# EAGLE design xiao-rp2040 (EAGLE 9.5.1)
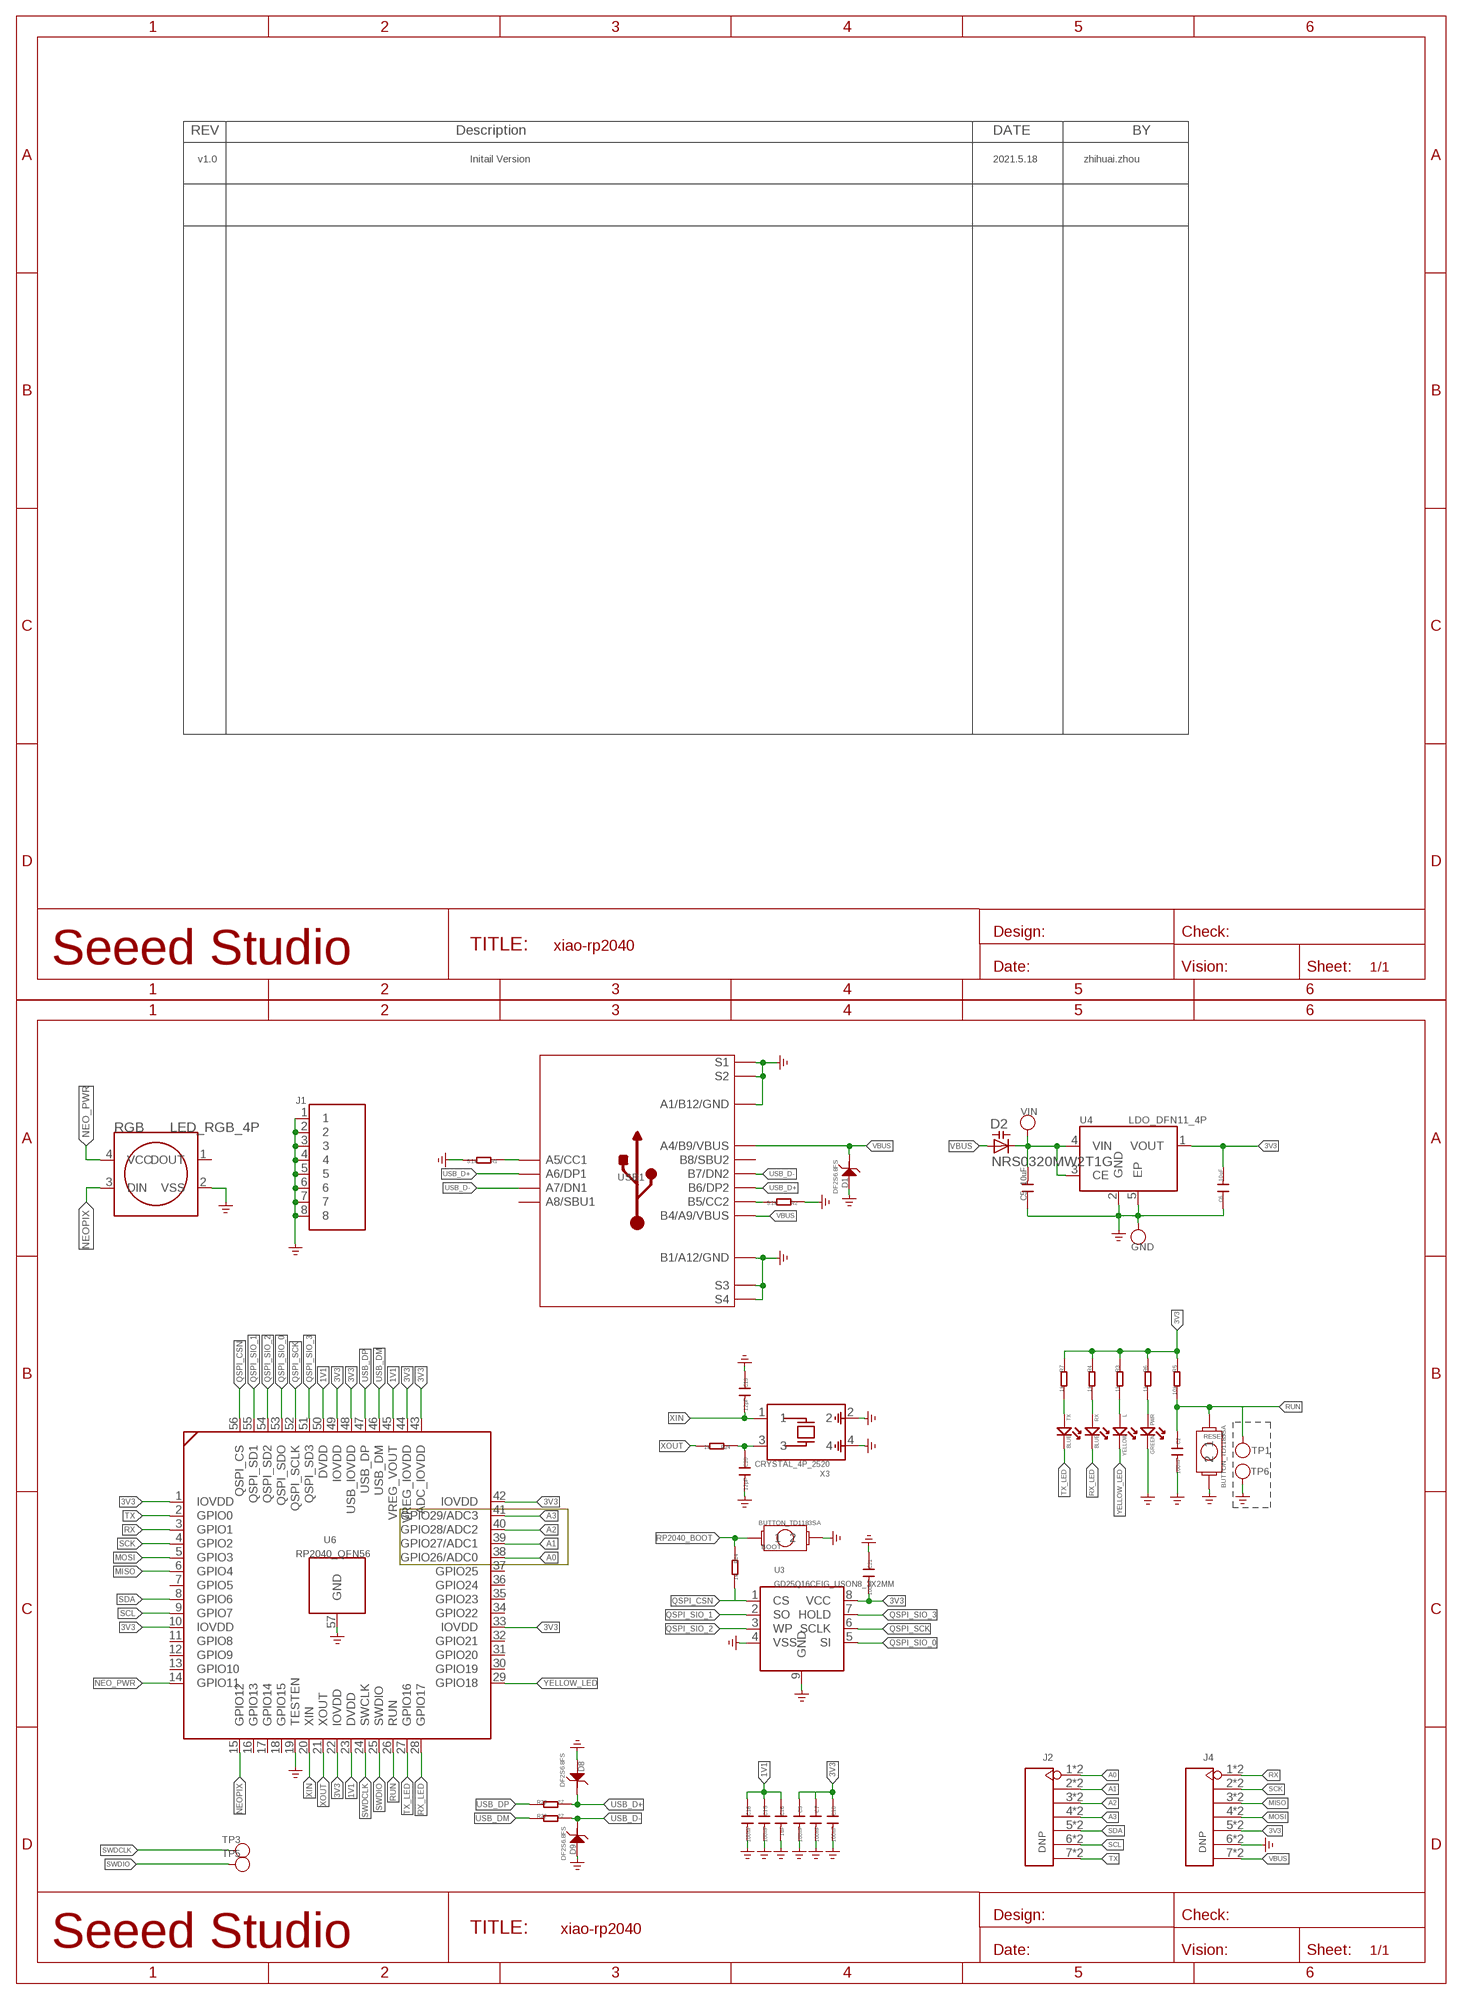
[diagram p0: schematic, sheet 1]

## Parts
BOOT  BUTTON_TD1183SA  [BUTTON_TD1183SA]
C2  100nF  CAP\0201NNS  [0201_NORMAL\NOSILK]
C3  100nF  CAP\0201NNS  [0201_NORMAL\NOSILK]
C5  10uF  C-0402  [C0402]
C6  10uF  C-0402  [C0402]
C7  100nF  CAP\0201NNS  [0201_NORMAL\NOSILK]
C10  100nF  CAP\0201NNS  [0201_NORMAL\NOSILK]
C15  100nF  CAP\0201NNS  [0201_NORMAL\NOSILK]
C16  1uF  CAP\0201NNS  [0201_NORMAL\NOSILK]
C18  100nF  CAP\0201NNS  [0201_NORMAL\NOSILK]
C19  12pF  CAP\0201NNS  [0201_NORMAL\NOSILK]
C20  12pF  CAP\0201NNS  [0201_NORMAL\NOSILK]
C21  100nF  CAP\0201NNS  [0201_NORMAL\NOSILK]
D1  DF2S6.8FS  D-ESD-2P'DF2S6.8FS'  [SOD-923]
D2  NRS0320MW2T1G  DIODE_CAPACITANCE-SOD523  [SOD523]
D8  DF2S6.8FS  D-ESD-2P'DF2S6.8FS'  [SOD-923]
D9  DF2S6.8FS  D-ESD-2P'DF2S6.8FS'  [SOD-923]
GND  TEST-POINT'4080'  [TP-80X40MIL]
J1  SHIELDING-COVER-XIAO_RP2040_PRD  [SHIELDING-COVER_XIAO_RP2040_PRD]
J2  DNP  HEADER-7P-HALF-HOLE-2.54  [H7-HALF-HOLE-2.54]
J4  DNP  HEADER-7P-HALF-HOLE-2.54  [H7-HALF-HOLE-2.54]
L  YELLOW  LED-0402  [LED-0402]
PWR  GREEN  LED-0402  [LED-0402]
R1  5.1k  R-0201  [R0201]
R2  5.1k  R-0201  [R0201]
R3  1k  R-0201  [R0201]
R4  1k  R-0201  [R0201]
R5  10k  R-0201  [R0201]
R6  1k  R-0201  [R0201]
R7  1k  R-0201  [R0201]
R14  1k  R-0201  [R0201]
R22  27  R-0201  [R0201]
R23  27  R-0201  [R0201]
R24  1k  R-0201  [R0201]
RESET  BUTTON_TD1183SA  [BUTTON_TD1183SA]
RGB  LED_RGB_4P  [LED_RGB_2427]
RX  BLUE  LED-0402  [LED-0402]
TP1  TEST-POINT'4545'  [TP-D45MIL]
TP3  TEST-POINT'4545'  [TP-D45MIL]
TP5  TEST-POINT'4545'  [TP-D45MIL]
TP6  TEST-POINT'4545'  [TP-D45MIL]
TX  BLUE  LED-0402  [LED-0402]
U3  GD25Q16CEIG_USON8_3X2MM  [GD25Q16CEIG_USON8_3X2MM]
U4  LDO_DFN11_4P  [LDO_DFN1*1_4P]
U6  RP2040_QFN56  [RP2040_QFN56]
USB1  USB2.0-TYPE-C  [USB2.0-TYPE-C]
VIN  TEST-POINT'4080'  [TP-80X40MIL]
X3  CRYSTAL_4P_2520  [CRYSTAL_4P_2520]

## Nets
1V1: C15.1 C16.1 C18.1 U6.23(DVDD) U6.45(VREG_VOUT) U6.50(DVDD)
3V3: C3.1 C6.2 C7.1 C10.1 C21.2 J4.5 J4.17 R3.1 R4.1 R5.1 R6.1 R7.1 U3.8(VCC) U4.1(VOUT) U6.1(IOVDD) U6.10(IOVDD) U6.22(IOVDD) U6.33(IOVDD) U6.42(IOVDD) U6.43(ADC_IOVDD) U6.44(VREG_IOVDD) U6.48(USB_IOVDD) U6.49(IOVDD)
A0: J2.1 J2.13 U6.38(GPIO26/ADC0)
A1: J2.2 J2.14 U6.39(GPIO27/ADC1)
A2: J2.3 J2.15 U6.40(GPIO28/ADC2)
A3: J2.4 J2.16 U6.41(GPIO29/ADC3)
GND: BOOT.2 C2.2 C3.2 C5.1 C6.1 C7.2 C10.2 C15.2 C16.2 C18.2 C19.1 C20.2 C21.1 D1.2 D8.2 D9.2 GND.1(T) J1.1 J1.2 J1.3 J1.4 J1.5 J1.6 J1.7 J1.8 J4.6 J4.18 PWR.- R1.2 R2.1 RESET.2 RGB.2(VSS) TP6.T U3.4(VSS) U3.9(GND) U4.2(GND) U4.5(EP) U6.19(TESTEN) U6.57(GND) USB1.A1_B12(A1/B12/GND) USB1.B1_A12(B1/A12/GND) USB1.S1 USB1.S2 USB1.S3 USB1.S4 USB1.S5(S1) USB1.S6(S2) X3.2 X3.4 ; supply symbol labelled GND_POWER
MISO: J4.3 J4.15 U6.6(GPIO4)
MOSI: J4.4 J4.16 U6.5(GPIO3)
N$1: R1.1 USB1.A5(A5/CC1)
N$2: R2.2 USB1.B5(B5/CC2)
N$5: L.+ R3.2
N$6: R7.2 TX.+
N$8: C20.1 R24.1 X3.3
N$9: R4.2 RX.+
N$16: PWR.+ R6.2
NEO_PWR: RGB.4(VCC) U6.14(GPIO11)
NEOPIX: RGB.3(DIN) U6.15(GPIO12)
QSPI_CSN: R14.2 U3.1(CS) U6.56(QSPI_CS)
QSPI_SCK: U3.6(SCLK) U6.52(QSPI_SCLK)
QSPI_SIO_0: U3.5(SI) U6.53(QSPI_SDO)
QSPI_SIO_1: U3.2(SO) U6.55(QSPI_SD1)
QSPI_SIO_2: U3.3(WP) U6.54(QSPI_SD2)
QSPI_SIO_3: U3.7(HOLD) U6.51(QSPI_SD3)
RP2040_BOOT: BOOT.1 R14.1
RUN: C2.1 R5.2 RESET.1 TP1.T U6.26(RUN)
RX: J4.1 J4.13 U6.3(GPIO1)
RX_LED: RX.- U6.28(GPIO17)
SCK: J4.2 J4.14 U6.4(GPIO2)
SCL: J2.6 J2.18 U6.9(GPIO7)
SDA: J2.5 J2.17 U6.8(GPIO6)
SWDCLK: TP3.T U6.24(SWCLK)
SWDIO: TP5.T U6.25(SWDIO)
TX: J2.7 J2.19 U6.2(GPIO0)
TX_LED: TX.- U6.27(GPIO16)
USB_D+: D8.1 R23.2 USB1.A6(A6/DP1) USB1.B6(B6/DP2)
USB_D-: D9.1 R22.2 USB1.A7(A7/DN1) USB1.B7(B7/DN2)
USB_DM: R22.1 U6.46(USB_DM)
USB_DP: R23.1 U6.47(USB_DP)
VBUS: D1.1 D2.A J4.7 J4.19 USB1.A4_B9(A4/B9/VBUS) USB1.B4_A9(B4/A9/VBUS)
VIN: C5.2 D2.C U4.3(CE) U4.4(VIN) VIN.1(T)
XIN: C19.2 U6.20(XIN) X3.1
XOUT: R24.2 U6.21(XOUT)
YELLOW_LED: L.- U6.29(GPIO18)
Unconnected: RGB.1(DOUT) U6.7(GPIO5) U6.11(GPIO8) U6.12(GPIO9) U6.13(GPIO10) U6.16(GPIO13) U6.17(GPIO14) U6.18(GPIO15) U6.30(GPIO19) U6.31(GPIO20) U6.32(GPIO21) U6.34(GPIO22) U6.35(GPIO23) U6.36(GPIO24) U6.37(GPIO25) USB1.A8(A8/SBU1) USB1.B8(B8/SBU2)

## Notes on the sheet
- v1.0 | Initail Version | 2021.5.18 | zhihuai.zhou

## Library data of the parts
BOOT RESET = BUTTON_TD1183SA:BUTTON_TD1183SA: 德艺隆:TD-1183SA/311020740
C2 C3 C7 C10 C15 C16 C18-C21 = Seeed-Discrete:CAP: Ceramic Capacitors
C5 C6 = XIAO RP2040 PRD v1.0:C*: Ceramic Capacitors
D1 D8 D9 = Discrete-new:D-ESD-2P: SOD-923:304060009;SOD-123:304060001
D2 = XIAO RP2040 PRD v1.0:DIODE_CAPACITANCE-: Capacity DIODE
GND VIN = Discrete-new:TEST-POINT
J1 = XIAO RP2040 PRD v1.0:SHIELDING-COVER-XIAO_RP2040_PRD
J2 J4 = Connector-new:HEADER-7P-HALF-HOLE
L PWR RX TX = Discrete-small:LED
R1-R7 R14 R22-R24 = XIAO RP2040 PRD v1.0:R*
RGB = XIAO RP2040 PRD v1.0:LED_RGB_4P
TP1 TP3 TP5 TP6 = Discrete-new:TEST-POINT; PARTNO: DNP
U3 = FLASH_GD25Q16CEIG_2:GD25Q16CEIG_USON8_3X2MM
U4 = LDO_DFN1X1_4P:LDO_DFN1*1_4P
U6 = RP2040_QFN56:RP2040_QFN56
USB1 = USB C:USB2.0-TYPE-C
X3 = CRYSTAL_4P:CRYSTAL_4P_2520

## Net classes
1 power: width 0.152 mm, drill 0.152 mm, clearance 0.152 mm
2 gnd: width 0.152 mm, drill 0.152 mm, clearance 0.152 mm
3 usbvcc: width 0.152 mm, drill 0.152 mm, clearance 0.152 mm

## Board
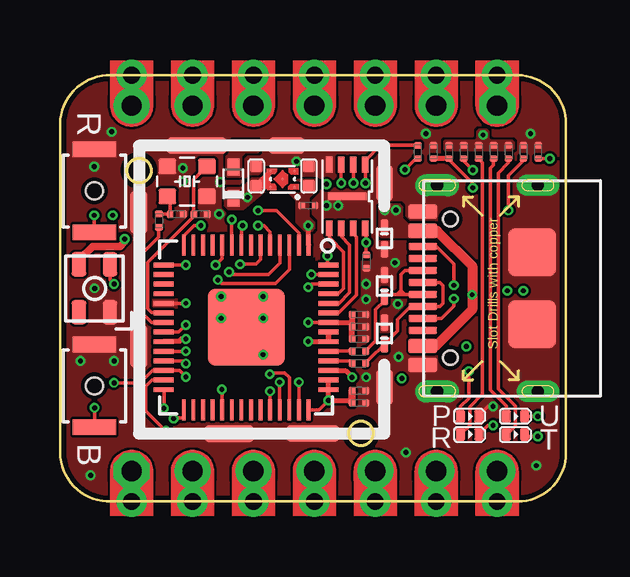
[diagram p1: board, top side]
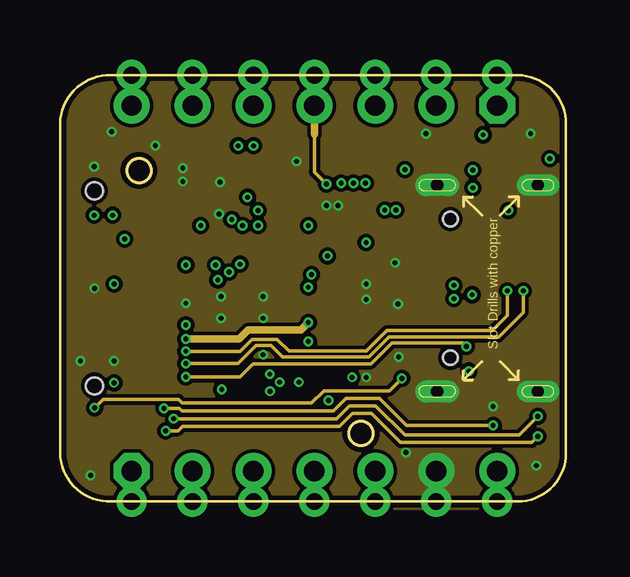
[diagram p2: board, inner layer Route2]
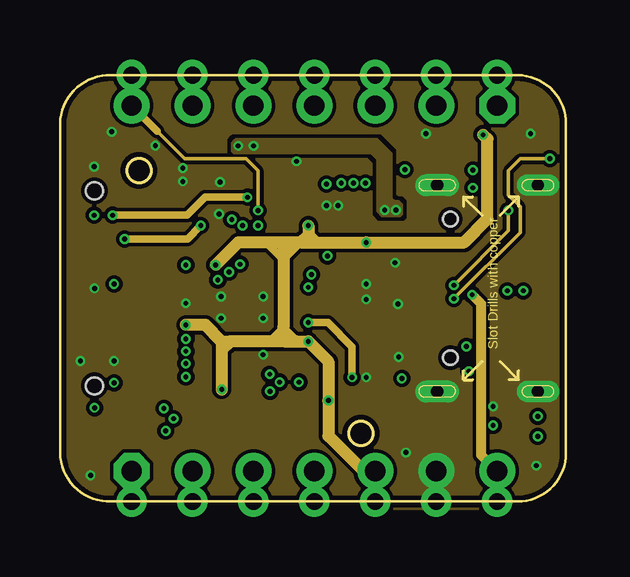
[diagram p3: board, inner layer Route15]
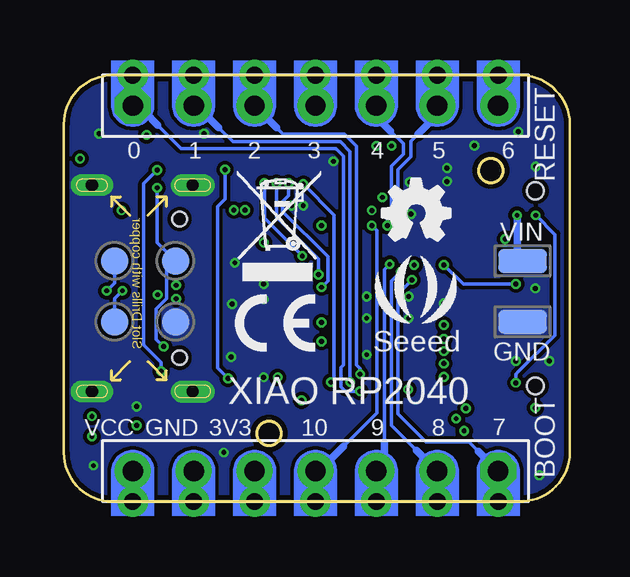
[diagram p4: board, bottom side, seen from below]

Size 21.1 x 17.78 mm. Coordinates in mm from the lower left corner, seen from the top.
Outline: 2.13,0 19.07,0 arc90 21.1,2.03 21.1,15.75 arc90 19.07,17.78 2.13,17.78 arc90 0,15.75 0,2.03 arc90 2.13,0
Copper layers (1+2*15+16): Top 0.035mm / dielectric 0.2mm / Route2 0.0175mm / dielectric 1.1mm / Route15 0.0175mm / dielectric 0.2mm / Bottom 0.035mm
Design rules "SeeedStudio_2layer_DRU_no_angle_20140221 *": minimum track width 1mil, minimum drill 8mil, track to track 4mil, track to pad 4mil, pad to pad 6mil, via to via 4mil, smd to smd 0mil, copper to edge 8mil, drill to drill 10mil, minimum pad ring 4mil, minimum via ring 4mil, stop-mask expansion 2mil, vias tented up to drill 25mil, thermal gap 0mil
tRestrict: area 4.9,4.3 to 10.6,10.2

### Footprints (pad centres in the part's own frame; a part is rotated, then mirrored left to right if it is on the bottom)
BUTTON_TD1183SA = smd 0.65 x 1.8: 1 -1.725,0; 2 1.725,0 | hole 0.7: 0,0
0201_NORMAL\NOSILK = smd 0.279 x 0.318: 1 -0.279,0; 2 0.279,0
C0402 = smd 0.508 x 0.508: 1 -0.406,0; 2 0.406,0
SOD-923 = smd 0.7 x 0.3: 1 -0.45,0; 2 0.45,0
SOD523 = smd 0.7 x 0.5: A 0.7,0; C -0.6,0
TP-80X40MIL = smd 2.032 x 1.016: 1 0,0
SHIELDING-COVER_XIAO_RP2040_PRD = smd 0.7 x 1.778: 1 -4.953,3.556; 2 -4.953,-2.032 | smd 2.032 x 0.7: 3 -1.18,-5.673 | smd 2.2 x 0.7: 4 2.29,-5.668 | smd 0.7 x 1.5: 5 5.283,-3.737; 6 5.283,4.772 | smd 1.5 x 0.7: 7 1.216,6.332 | smd 2.5 x 0.7: 8 -2.54,6.332 | hole 1: -4.953,5.3; 4.3,-5.672
H7-HALF-HOLE-2.54 = drill 0.85 pad 1.5 octagon: 1 0,7.62 | drill 0.85 pad 1.5: 2 0,5.08; 3 0,2.54; 4 0,0; 5 0,-2.54; 6 0,-5.08; 7 0,-7.62 | drill 0.7 pad 1.27: 13 -1.27,7.62; 14 -1.27,5.08; 15 -1.27,2.54; 16 -1.27,0; 17 -1.27,-2.54; 18 -1.27,-5.08; 19 -1.27,-7.62
LED-0402 = smd 0.385 x 0.508: + -0.383,0; - 0.383,0
R0201 = smd 0.279 x 0.318: 1 -0.279,0; 2 0.279,0
LED_RGB_2427 = smd 1 x 0.6: 1 1,-0.65; 2 1,0.65; 3 -1,0.65; 4 -1,-0.65
TP-D45MIL = smd 1.143 x 1.143: T 0,0
GD25Q16CEIG_USON8_3X2MM = smd 0.65 x 0.3: 1 -1.33,0.75; 2 -1.33,0.25; 3 -1.33,-0.25; 4 -1.33,-0.75; 5 1.33,-0.75; 6 1.33,-0.25; 7 1.33,0.25; 8 1.33,0.75 | smd 0.3 x 1.6: 9 0,0
LDO_DFN1*1_4P = smd 0.1 x 0.1: 1 -0.33,-0.5; 2 0.33,-0.5; 3 0.33,0.51; 4 -0.33,0.5; 5 0,0
RP2040_QFN56 = smd 0.875 x 0.2: 1 -3.438,2.6; 2 -3.438,2.2; 3 -3.438,1.8; 4 -3.438,1.4; 5 -3.438,1; 6 -3.438,0.6; 7 -3.438,0.2; 8 -3.438,-0.2; 9 -3.438,-0.6; 10 -3.438,-1; 11 -3.438,-1.4; 12 -3.438,-1.8; 13 -3.438,-2.2; 14 -3.438,-2.6; 29 3.438,-2.6; 30 3.438,-2.2; 31 3.438,-1.8; 32 3.438,-1.4; 33 3.438,-1; 34 3.438,-0.6; 35 3.438,-0.2; 36 3.438,0.2; 37 3.438,0.6; 38 3.438,1; 39 3.438,1.4; 40 3.438,1.8; 41 3.438,2.2; 42 3.438,2.6 | smd 0.2 x 0.875: 15 -2.6,-3.438; 16 -2.2,-3.438; 17 -1.8,-3.438; 18 -1.4,-3.438; 19 -1,-3.438; 20 -0.6,-3.438; 21 -0.2,-3.438; 22 0.2,-3.438; 23 0.6,-3.438; 24 1,-3.438; 25 1.4,-3.438; 26 1.8,-3.438; 27 2.2,-3.438; 28 2.6,-3.438; 43 2.6,3.438; 44 2.2,3.438; 45 1.8,3.438; 46 1.4,3.438; 47 1,3.438; 48 0.6,3.438; 49 0.2,3.438; 50 -0.2,3.438; 51 -0.6,3.438; 52 -1,3.438; 53 -1.4,3.438; 54 -1.8,3.438; 55 -2.2,3.438; 56 -2.6,3.438 | smd 3.2 x 3.2: 57 0,0
USB2.0-TYPE-C = smd 1.2 x 0.6: A1_B12 0.05,3.2; A4_B9 0.05,2.4; B1_A12 0.05,-3.2; B4_A9 0.05,-2.4 | smd 1.2 x 0.3: A5 0.05,1.25; A6 0.05,0.25; A7 0.05,-0.25; A8 0.05,-1.25; B5 0.05,-1.75; B6 0.05,-0.75; B7 0.05,0.75; B8 0.05,1.75 | drill 0.508 pad 0.889 long: S1 -4.75,4.3; S2 -4.75,-4.3 | drill 0.508 pad 0.914 long: S3 -0.55,4.3; S4 -0.55,-4.3 | smd 2 x 2: S5 -4.5,1.5; S6 -4.5,-1.5 | hole 0.6: -1.1,-2.89; -1.1,2.89
CRYSTAL_4P_2520 = smd 0.75 x 0.65: 1 -0.825,-0.625; 2 0.825,-0.625; 3 0.825,0.625; 4 -0.825,0.625

### Placement (x,y rotation side)
BOOT  1.44,4.83 90 top
C2  15.57,14.58 90 top
C3  10.36,12.34 0 top
C5  8.18,13.58 270 top
C6  10.38,13.58 270 top
C7  12.46,4.62 0 top
C10  12.46,4.11 0 top
C15  12.46,7.8 0 top
C16  12.46,6.78 0 top
C18  12.46,7.29 0 top
C19  5.87,11.97 180 top
C20  4.87,11.97 0 top
C21  12.78,10.01 90 top
D1  13.53,10.97 270 top
D2  7.23,13.25 90 top
D8  13.53,8.99 90 top
D9  13.53,7.01 90 top
GND  1.97,7.49 0 bottom
J1  8.25,8.51 0 top
J2  10.61,16.51 270 top
J4  10.61,1.27 90 top
L  18.99,3.56 0 top
PWR  17.09,3.56 0 top
R1  19.94,14.58 90 top
R2  19.32,14.58 270 top
R3  18.08,14.58 270 top
R4  17.46,14.58 270 top
R5  16.22,14.58 270 top
R6  16.84,14.58 270 top
R7  18.7,14.58 270 top
R14  14.93,14.58 90 top
R22  12.46,5.77 0 top
R23  12.46,6.27 0 top
R24  4.12,11.71 270 top
RESET  1.44,12.95 90 top
RGB  1.44,8.89 270 top
RX  17.09,2.79 0 top
TP1  16.45,10.03 0 bottom
TP3  18.99,7.49 0 bottom
TP5  18.99,10.03 0 bottom
TP6  16.45,7.49 0 bottom
TX  18.99,2.79 0 top
U3  11.98,12.73 270 top
U4  9.29,13.44 90 top
U6  7.76,7.26 270 top
U$4  [OSHW_FILLX100_NOTEXT]  7.82,10.9 0 bottom
U$6  [SEEED-SILK--TNAME-160*153MIL]  6.4,8.93 0 bottom
USB1  15.18,8.89 180 top
VIN  1.97,10.03 180 bottom
X3  5.3,13.35 180 top

### Tracks (layer width: path | path; a pad name or v marks a point on that pad's centre or on a via)
1V1  (via drill 0.2 pad 0.41)
  Top 0.152: v10.36,7.46 U6.50
  Top 0.203: U6.50 12.18,7.46 C18.1 | U6.23 4.34,6.68 4.97,6.68 5.07,6.78 v5.25,6.78 | U6.45 11.9,5.46 v12.18,5.18
  Top 0.254: C15.1 C18.1 C16.1
  Route2 0.305: v5.25,6.78 7.48,6.78 7.85,7.16 10.05,7.16 v10.36,7.46
  Route15 0.305: v12.18,5.18 12.18,6.45 11.17,7.46 v10.36,7.46
3V3  (via drill 0.2 pad 0.41)
  Top 0.152: U6.22 4.95,7.06 v5.25,7.37 | v11.19,4.22 10.8,3.83 U6.42 | U3.8 12.77,11.36 v12.77,10.8 12.77,10.3 C21.2 | v6.75,4.67 6.76,4.66 U6.33 | v6.49,9.87 6.76,10.14 U6.10
  Top 0.203: U6.48 U6.49 11.2,6.68 v10.36,6.68 | U6.44 U6.43 v11.19,4.22 12.08,4.22 C10.1 | U6.42 10.38,3.84 | U6.1 v10.36,11.51
  Top 0.254: J4.5 J4.17
  Top 0.305: C10.1 C7.1
  Route15 0.305: 8.59,10.8 9.26,10.14 9.31,10.14 9.37,10.14 10.04,10.8 | 8.59,6.68 8.73,6.68 9.31,7.26 9.85,6.73 9.85,6.68
  Route15 0.508: 9.34,6.68 9.85,6.68 v10.36,6.68 11.19,5.84 v11.19,4.22 11.19,2.73 12.66,1.27 J4.5 | 9.34,6.68 8.59,6.68 7.1,6.68 | 6.75,6.68 7.1,6.68 | 10.36,10.8 10.67,10.8 | v10.36,11.51 10.36,11.12 | 10.36,11.12 10.36,10.8 | 10.04,10.8 10.36,10.8 | 10.04,10.8 9.31,10.8 | 9.31,10.8 8.59,10.8 7.43,10.8 v6.49,9.87 | 7.1,6.68 6.75,6.33 | 10.04,10.8 10.36,11.12 | 10.36,11.12 10.67,10.8 | 9.31,10.8 9.31,10.14 9.31,7.26 9.31,6.71 9.34,6.68 | 6.75,6.68 6.75,6.33 | v17.65,15.29 17.82,15.11 17.82,11.77 16.85,10.8 v12.77,10.8 10.67,10.8 | v5.25,7.37 6.06,7.37 6.75,6.68 | 6.75,6.33 v6.75,4.67
  pour Top: 9.5,13.06 9.9,13.45 10.63,13.45 10.72,13.36 10.72,12.99 10.38,12.65 10.38,11.89 10.62,11.65 10.62,11.38 10.51,11.26 10.22,11.26 9.85,11.63 9.85,12.55 9.5,12.89
  pour Top: 16.06,15.07 15.99,15.01 15.99,14.69 16.06,14.63 18.85,14.63 18.97,14.74 18.97,14.96 18.86,15.06 17.99,15.06 17.91,15.14 17.91,15.43 17.81,15.53 17.47,15.53 17.37,15.43 17.37,15.14 17.3,15.07
A0  (via drill 0.2 pad 0.41)
  Top 0.152: v8.76,4.6 U6.38
  Top 0.254: J2.1 J2.13
  Bottom 0.152: 17.19,15.7 16.21,14.72 9.75,14.72 9.44,14.41 9.44,5.7 9.54,5.6 9.54,4.79 9.35,4.6 9,4.6 v8.76,4.6
  Bottom 0.305: 17.19,15.7 17.72,16.23 17.95,16.23 J2.1
A1  (via drill 0.2 pad 0.41)
  Top 0.152: v9.16,4.98 U6.39
  Top 0.254: J2.2 J2.14
  Bottom 0.102: J2.2 15.69,16
  Bottom 0.152: 14.65,15.6 14.05,15 9.57,15 9.16,14.59 v9.16,4.98
  Bottom 0.305: 14.65,15.6 15.08,16.03 15.66,16.03 15.69,16
A2  (via drill 0.2 pad 0.41)
  Top 0.152: U6.40 9.57,5.17 9.36,5.37 8.81,5.37 v8.75,5.31
  Top 0.254: J2.3 J2.15
  Bottom 0.152: 12.34,15.7 12.34,15.65 | v8.75,5.31 8.75,5.55 8.9,5.7 8.9,14.82 9.39,15.32 11.96,15.32 12.24,15.6
  Bottom 0.305: J2.3 12.34,15.7 12.24,15.6
A3  (via drill 0.2 pad 0.41)
  Top 0.152: v9.96,4.98 U6.41
  Top 0.254: J2.4 J2.16
  Route2 0.152: 10.61,15.32 10.61,13.74 v11.12,13.23
  Route2 0.305: J2.4 10.61,15.32
  Bottom 0.152: v9.96,4.98 9.83,5.11 9.83,11.95 v11.12,13.23
GND  (via drill 0.2 pad 0.41)
  Top 0.152: v18.06,3.96 17.84,3.96 17.47,3.59 PWR.- | v5.25,8.27 v5.25,8.26 U6.19
  Top 0.305: U6.57 7.76,6.83 v8.48,6.12
  other vias: 8.48,7.65 6.72,7.65 8.48,8.55 1.44,8.89 0.86,5.87 2.25,5.87 1.43,13.97 2.15,15.42 3.98,14.85 6.68,13.32 11.12,12.34 11.6,12.34 12.77,8.43 12.77,9.07 12.77,5.18 1.28,1.09 19.87,1.5 14.43,2.04 19.63,15.34 15.26,15.34 6.72,8.55 5.12,13.91 9.86,14.19 14.13,6.03 14.09,8.24 13.98,9.96 6.63,11.99 5.12,13.35
  pour Top (rank 3, no thermals): -0.19,17.93 21.51,17.93 21.53,17.91 21.53,-0.28 3.88,-0.28 3.88,-0.91 2.08,-0.91 2.08,-0.25 -0.21,-0.25
  pour Route2 (isolate 0.152, rank 6, no thermals): -0.19,17.93 21.51,17.93 21.53,17.91 21.53,-0.28 3.88,-0.28 3.85,-1.24 2.08,-1.24 2.08,-0.25 -0.21,-0.25
  pour Route15 (isolate 0.152, rank 6, no thermals): -0.19,17.93 21.51,17.93 21.53,17.91 21.53,-0.28 3.88,-0.28 3.85,-1.57 2.08,-1.57 2.08,-0.25 -0.21,-0.25
  pour Bottom (isolate 0.152, rank 6, no thermals): -0.19,17.93 21.51,17.93 21.53,17.91 21.53,-0.28 3.88,-0.28 3.85,-1.93 2.08,-1.93 2.08,-0.25 -0.21,-0.25
MISO  (via drill 0.2 pad 0.41)
  Top 0.152: U6.6 8.37,10.69 8.37,10.08 8.19,9.9 v7.51,9.9
  Top 0.254: J4.3 J4.15
  Bottom 0.152: v7.51,9.9 7.74,9.67 7.74,2.49
  Bottom 0.305: J4.3 7.74,1.6 7.74,2.49
MOSI  (via drill 0.2 pad 0.41)
  Top 0.152: U6.5 8.76,11.24 8.5,11.51 v8.26,11.51
  Top 0.254: J4.4 J4.16
  Bottom 0.152: 9.59,2.15 8.04,3.7 8.04,11.29 v8.26,11.51
  Bottom 0.305: 9.44,2.3 9.59,2.15 10.47,1.27 J4.4
N$1  (via drill 0.2 pad 0.41)
  Top 0.152: USB1.A5 15.91,7.64 16.43,8.15 v16.43,8.46 | R1.1 v20.43,14.3
  Route15 0.152: v16.43,8.46 19.19,11.23 19.19,12.29 18.7,12.79 18.7,13.79 19.21,14.3 v20.43,14.3
N$2  (via drill 0.2 pad 0.41)
  Top 0.152: USB1.B5 15.69,10.64 16.43,9.91 v16.43,9.02 | v18.7,12.14 18.7,13.59 19.32,14.21 R2.2
  Route15 0.152: v16.43,9.02 18.7,11.29 v18.7,12.14
N$5
  Top 0.152: R3.2 18.08,14.04 17.95,13.91 17.95,4.65 18.61,3.99 L.+
N$6
  Top 0.152: TX.+ 18.64,2.79 18.99,3.15 18.99,3.99 18.28,4.7 18.28,13.7 18.7,14.12 R7.2
N$8
  Top 0.152: R24.1 4.57,11.99 C20.1 4.59,12.61 X3.3
N$9
  Top 0.152: RX.+ 17.09,3.18 17.09,3.95 17.62,4.48 17.62,14.14 R4.2
N$16  (via drill 0.2 pad 0.41)
  Top 0.152: PWR.+ 16.7,3.96 17.05,4.31 v17.05,5.44 | R6.2 16.84,14.2 v17.21,13.82
  Bottom 0.152: v17.21,13.82 17.77,13.26 17.77,6.53 17.05,5.8 v17.05,5.44
NEO_PWR  (via drill 0.2 pad 0.41)
  Top 0.152: RGB.4 0.79,10.07 | U6.14 5.16,11.08 5.59,11.51 v5.87,11.51
  Top 0.305: 0.79,10.07 1.37,10.64 2.5,10.64 2.7,10.84 v2.7,10.95
  Route15 0.305: v2.7,10.95 5.31,10.95 v5.87,11.51
NEOPIX  (via drill 0.2 pad 0.41)
  Top 0.152: v5.25,9.87 U6.15 | 2.09,9.49 RGB.3 2.09,9.23 v2.25,9.07
  Bottom 0.152: v2.25,9.07 4.45,9.07 v5.25,9.87
QSPI_CSN  (via drill 0.2 pad 0.41)
  Top 0.152: v11.16,10.25 11.15,10.24 11.15,9.92 U6.56 | R14.2 13.37,14.86 12.73,14.22 U3.1 12.74,14.04 v12.74,13.28
  Bottom 0.152: v11.16,10.25 12.74,11.83 v12.74,13.28
QSPI_SCK
  Top 0.152: U3.6 11.73,11.05 12.08,10.7 12.08,8.72 11.63,8.26 U6.52
QSPI_SIO_0
  Top 0.152: 11.28,11.23 11.28,11.35 U3.5 11.23,11.01 11.83,10.41 11.83,8.89 11.6,8.66 U6.53
QSPI_SIO_1  (via drill 0.2 pad 0.41)
  Top 0.152: v10.48,9.47 v10.49,9.46 U6.55 | v12.24,13.28 U3.2
  Bottom 0.152: 12.24,13.31 v12.24,13.28 12.24,11.86 10.48,10.11 v10.48,9.47
QSPI_SIO_2  (via drill 0.2 pad 0.41)
  Top 0.152: v11.73,13.28 U3.3 | v10.36,8.94 10.48,9.06 U6.54
  Bottom 0.152: v11.73,13.28 11.73,12.76 11.98,12.5 11.98,12.09 10.1,10.21 10.1,9.2 v10.36,8.94
QSPI_SIO_3
  Top 0.152: U6.51 11.61,7.86 12.37,8.62 12.37,11.04 12.23,11.18 U3.7
RP2040_BOOT  (via drill 0.2 pad 0.41)
  Top 0.152: v1.44,3.91 BOOT.1 | R14.1 14.84,14.3 v14.38,13.84
  Route2 0.152: v1.44,3.91 1.8,4.27 4.95,4.27 5.1,4.12 10.5,4.12 11,4.62 13.75,4.62 v14.25,5.13
  Bottom 0.152: v14.25,5.13 14.7,5.58 14.7,12.29 14.38,12.61 v14.38,13.84
RUN  (via drill 0.2 pad 0.41)
  Top 0.152: RESET.1 1.43,11.24 v1.43,11.94 | v17.21,13.08 17.21,13.27 16.22,14.27 R5.2 | v2.25,4.95 3.35,4.95 3.86,5.46 U6.26 4.98,5.46 v5.25,5.19
  Top 0.203: R5.2 C2.1
  Route2 0.152: v16.95,6.46 16.81,6.6 13.84,6.6 12.97,5.74 8.06,5.74 7.51,5.19 v5.25,5.19
  Bottom 0.152: v17.21,13.08 17.21,10.79 TP1.T 16.81,9.68 16.81,8.46 17.25,8.02 17.25,6.77 v16.95,6.46 | v1.43,11.94 0.63,11.14 0.63,6.93 2.16,5.4 2.24,5.32 2.25,5.31 v2.25,4.95
RX  (via drill 0.2 pad 0.41)
  Top 0.152: v6.58,9.25 6.74,9.09 8.98,9.09 9.57,9.68 U6.3 | J4.1 2.99,0.33
  Top 0.254: J4.1 J4.13
  Bottom 0.152: 3.81,2.09 4.21,2.49 6,2.49 7.17,3.66 7.17,8.66 v6.58,9.25 | v6.58,9.25
  Bottom 0.305: J4.1 3.81,2.09
RX_LED  (via drill 0.2 pad 0.41)
  Top 0.152: v4.34,3.89 U6.28 | RX.- 17.85,3.18 v18.06,3.18
  Route2 0.152: v4.34,3.89 4.97,3.89 5.09,3.77 11.4,3.77 11.93,4.31 13.31,4.31 14.44,3.18 v18.06,3.18
SCK  (via drill 0.2 pad 0.41)
  Top 0.152: v7.06,9.57 7.16,9.47 8.7,9.47 9.17,9.94 9.17,10.69 U6.4
  Top 0.254: J4.2 J4.14
  Bottom 0.152: 6.4,2.14 7.43,3.18 7.43,9.2 v7.06,9.57
  Bottom 0.305: J4.2 6.4,2.14
SCL  (via drill 0.2 pad 0.41)
  Top 0.152: U6.9 v7.16,11.76 v7.17,11.76
  Top 0.254: J2.6 J2.18
  Bottom 0.152: v7.17,11.76 7.17,13.84 6.63,14.38 6.63,15.02 6.33,15.33
  Bottom 0.305: J2.6 5.53,16.13 6.33,15.33
SDA  (via drill 0.2 pad 0.41)
  Top 0.152: U6.8 7.56,11.46 v7.61,11.51
  Top 0.254: J2.5 J2.17
  Bottom 0.152: v7.61,11.51 7.61,11.87 7.43,12.05 7.43,14 6.95,14.48 6.95,14.92 7.49,15.46
  Bottom 0.305: J2.5 8.07,16.04 7.49,15.46
SWDCLK  (via drill 0.2 pad 0.41)
  Top 0.152: v5.25,6.27 U6.24
  Route2 0.152: v5.25,6.27 7.52,6.27 8.01,6.76 9.05,6.76 9.54,6.27 10.14,6.27 12.78,6.27 13.63,7.13 18.03,7.13 18.66,7.76 v18.66,8.79
  Bottom 0.152: v18.66,8.79 18.99,8.46 TP3.T
SWDIO  (via drill 0.2 pad 0.41)
  Top 0.152: v5.25,5.75 5.14,5.86 U6.25
  Route2 0.152: v5.25,5.75 7.43,5.75 8.17,6.5 8.79,6.5 9.28,6.02 12.88,6.02 13.72,6.86 18.29,6.86 19.32,7.89 v19.32,8.79
  Bottom 0.152: v19.32,8.79 18.99,9.12 TP5.T
TX  (via drill 0.2 pad 0.41)
  Top 0.152: U6.2 9.96,11.2 9.02,12.14 v8.26,12.14
  Top 0.254: J2.7 J2.19
  Route15 0.152: v8.26,12.14 8.26,13.8 7.76,14.3 5.2,14.3 4.06,15.44
  Route15 0.305: 4.06,15.44 J2.7
TX_LED  (via drill 0.2 pad 0.41)
  Top 0.152: v4.41,2.95 3.57,3.79 3.57,4.8 3.84,5.06 U6.27 | v19.93,2.72 19.45,2.72 TX.-
  Route2 0.152: v4.41,2.95 4.92,2.95 5.11,3.14 11.66,3.14 12.2,3.68 12.98,3.68 14.2,2.46 19.68,2.46 v19.93,2.72
USB_D+
  Top 0.102: USB1.A6
  Top 0.152: USB1.B6 14.38,9.64 14.22,9.47 14.22,8.8 | R23.2 12.91,6.45 12.92,6.45 13.16,6.69 13.16,8 13.53,8.37 D8.1 13.62,8.54 13.72,8.64 | 13.63,8.64 13.72,8.64 | 13.72,8.64 13.92,8.64 14.05,8.64 | 14.05,8.64 14.22,8.64 | 14.22,8.64 14.38,8.64 | 14.38,8.64 USB1.A6 | 14.22,8.8 14.22,8.64 | 14.05,8.64 14.22,8.8 | 14.22,8.8 14.38,8.64
USB_D-
  Top 0.152: USB1.A7 15.84,9.14 15.97,9.02 15.97,8.26 15.85,8.14 USB1.B7 15.12,8.13 14.62,8.13 14.08,7.59 14.08,7.11 D9.1 12.92,5.94 12.91,5.94 R22.2
USB_DM
  Top 0.152: U6.46 12.09,5.86 R22.1
USB_DP
  Top 0.152: R23.1 11.2,6.27 U6.47
VBUS  (via drill 0.2 pad 0.41)
  Top 0.254: J4.7 J4.19
  Top 0.406: USB1.B4_A9 15.73,11.29 17.19,9.83 v17.19,8.62 17.19,8 15.69,6.5 15.14,6.5 USB1.A4_B9
  Route15 0.406: v17.19,8.62 17.56,8.26 17.56,1.94 J4.7
  other vias: 13.54,12.15 14.01,12.15 7.43,14.83 8.07,14.83
  pour Bottom (isolate 0.254, no thermals): 18.38,1.37 18,0.99 17.72,0.99
  pour Top: 13.38,11.01 15.64,11.01 15.69,11.06 15.69,11.53 15.65,11.57 14.53,11.57 14.31,11.8 14.31,12.08 14.31,12.28 14.18,12.41 13.42,12.41 13.28,12.27 13.28,11.98 13.28,11.11
  pour Top: 6.96,13.54 7.54,13.54 7.59,13.59 7.59,14.4 7.74,14.55 8.26,14.55 8.35,14.64 8.35,14.97 8.25,15.07 7.23,15.07 6.9,14.74 6.9,13.6
  pour Route15: 7.27,15.09 7.13,14.95 7.13,14.62 7.24,14.5 7.5,14.5 12.97,14.5 13.19,14.29 13.19,12.1 13.4,11.89 14.2,11.89 14.31,11.99 14.31,12.38 14.14,12.55 13.96,12.55 13.87,12.64 13.87,14.5 13.4,14.97 13.24,15.14 7.4,15.14 7.32,15.14
VIN  (via drill 0.2 pad 0.41)
  Top 0.152: C5.2 8.21,13.2 | C5.2 8.43,13.41 8.49,13.41 | 8.62,13.29 8.49,13.41 | 8.62,13.6 8.62,13.29 | U4.4 8.24,13.11 C5.2 | C5.2 8.35,13.17 | 8.35,13.17 8.5,13.17 8.62,13.29 | 8.49,13.41 8.49,13.31 8.35,13.17 | U4.3 8.7,13.69 8.7,13.2
  Top 0.254: U4.4 8.7,13.2 8.49,13.41 | U4.3 C5.2
  Route15 0.305: v2.2,11.94 5.3,11.94 6.05,12.69 v7.82,12.69
  Bottom 0.305: 2.3,9.98 2.28,10.01 1.52,10.01 | VIN.1 2.2,10.26 v2.2,11.94
  Bottom 0.406: VIN.1 1.31,10.03 1.34,10.01 1.52,10.01
  pour Top: 7.99,13.49 7.6,13.09 6.96,13.09 6.84,12.97 6.84,12.34 7.02,12.17 7.66,12.17 8.75,13.1 8.36,13.49
XIN
  Top 0.152: U6.20 4.32,7.87 3.83,7.87 3.65,8.05 3.65,9.97 5.59,11.9 C19.2 5.58,11.99 5.58,13.42 X3.1
XOUT
  Top 0.152: U6.21 3.83,7.46 3.35,7.95 3.35,10.26 4.12,11.04 R24.2
YELLOW_LED  (via drill 0.2 pad 0.41)
  Top 0.152: U6.29 5.16,3.49 5.17,3.48 4.77,3.48 v4.74,3.45 | v19.93,3.56 L.-
  Route2 0.152: v4.74,3.45 11.52,3.45 12.07,4 13.17,4 14.38,2.78 19.16,2.78 v19.93,3.56

### Text on the board
tPlace: R | B
tNames: P | U | R | T
bNames: 6 | 5 | 4 | 3 | 2 | 1 | 0 | VIN | GND | Seeed | XIAO RP2040 | 7 | 8 | 9 | 10 | 3V3 | GND | VCC
tTest: RUN | BOOT